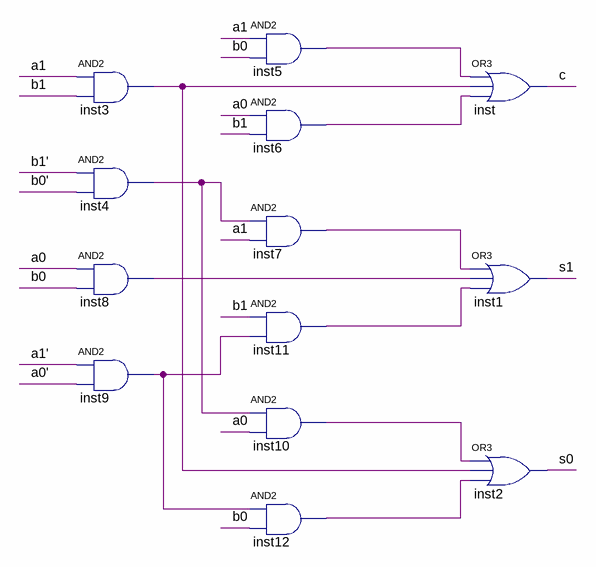
[diagram p0: schematic sheet]
// Quartus schematic Q2Design.bdf as structural Verilog: 13 symbols, 0 pins
module Q2Design (
);

  wire a0, \a0' , a1, \a1' , b0, \b0' , b1, \b1' , c, inst3_out, inst4_out, inst5_out, inst6_out, inst7_out,
       inst8_out, inst9_out, inst10_out, inst11_out, inst12_out, s0, s1;

  and inst3 (inst3_out, a1, b1);
  and inst4 (inst4_out, \b1' , \b0' );
  and inst8 (inst8_out, a0, b0);
  and inst9 (inst9_out, \a1' , \a0' );
  and inst5 (inst5_out, a1, b0);
  and inst6 (inst6_out, a0, b1);
  and inst7 (inst7_out, inst4_out, a1);
  and inst11 (inst11_out, b1, inst9_out);
  and inst10 (inst10_out, inst4_out, a0);
  and inst12 (inst12_out, inst9_out, b0);
  or inst (c, inst5_out, inst3_out, inst6_out);
  or inst1 (s1, inst7_out, inst8_out, inst11_out);
  or inst2 (s0, inst10_out, inst3_out, inst12_out);
endmodule
